# Altium project SDvp.PrjPcb
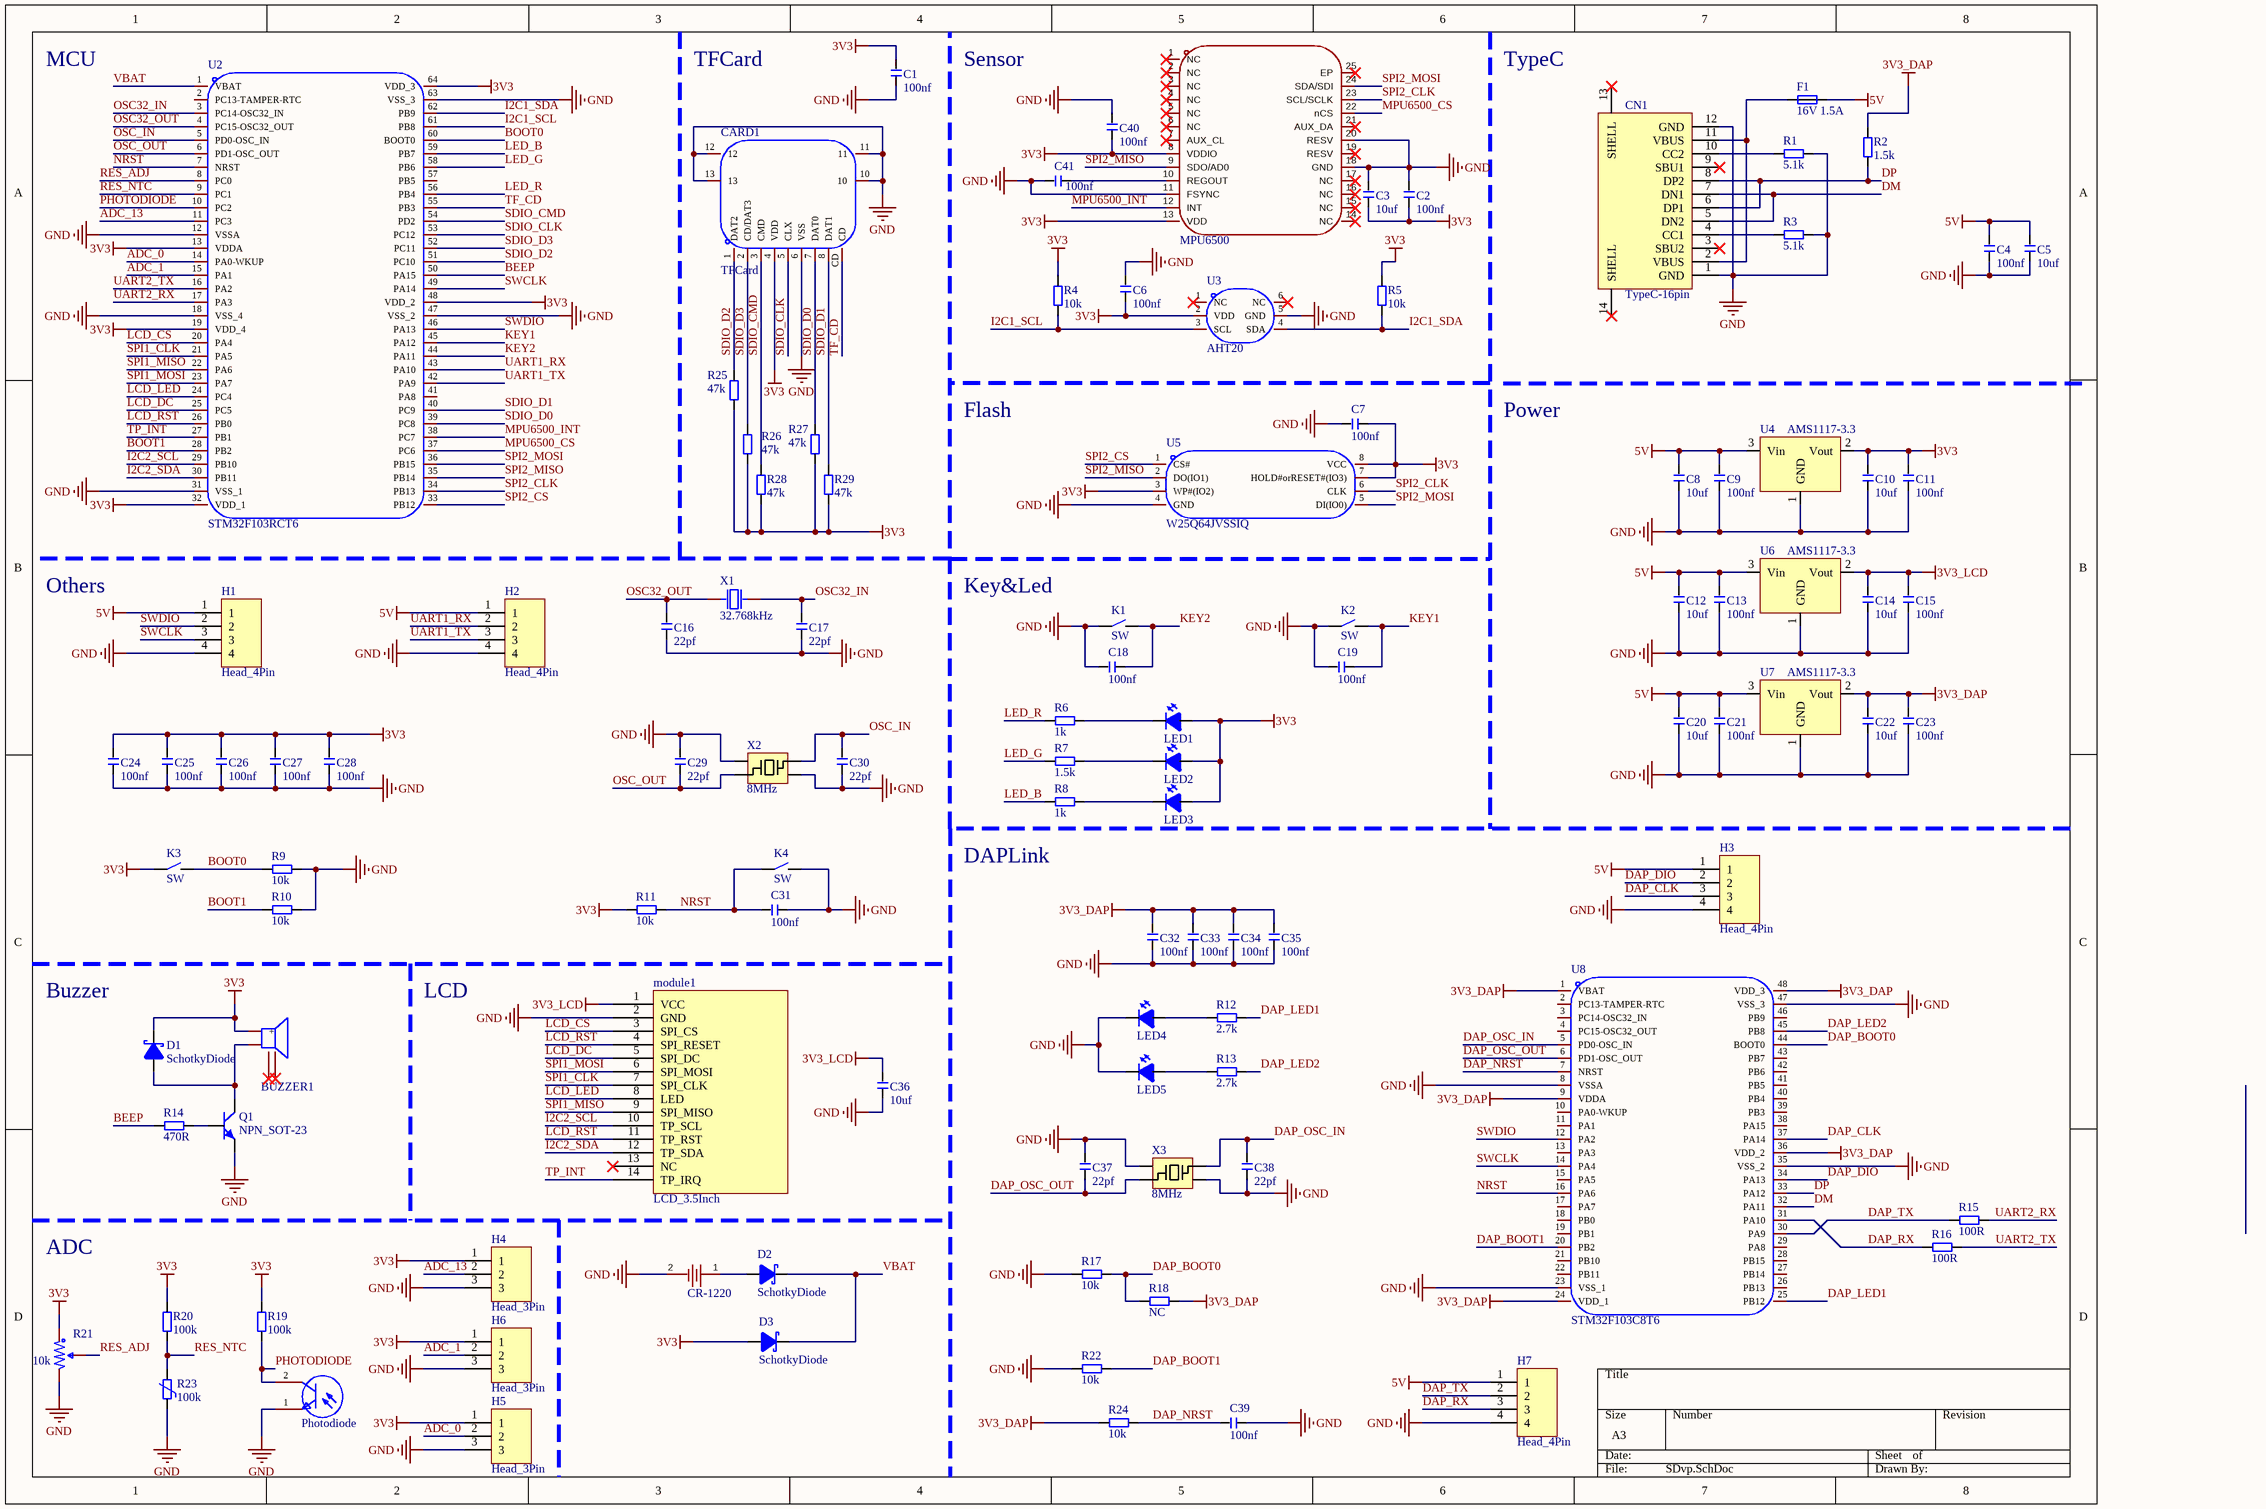
[diagram p0: SDvp.SchDoc]
1 sheet, 108 parts. Net scope: global (net labels, ports and power ports of the same name join across sheets).
Board file: SDvp.PcbDoc

## Sheet SDvp.SchDoc: S_develop
size A3; Revision: V0.1; SheetNumber: 1; SheetTotal: 1

### Parts
BUZZER1  PassiveBuzzer  [BUZ-SMD_8530]  (value not drawn)
C1  100nf  [CAP0603]
C2  100nf  [CAP0603]
C3  10uf  [CAP0603]
C4  100nf  [CAP0603]
C5  10uf  [CAP0603]
C6  100nf  [CAP0603]
C7  100nf  [CAP0603]
C8  10uf  [CAP0603]
C9  100nf  [CAP0603]
C10  10uf  [CAP0603]
C11  100nf  [CAP0603]
C12  10uf  [CAP0603]
C13  100nf  [CAP0603]
C14  10uf  [CAP0603]
C15  100nf  [CAP0603]
C16  22pf  [CAP0603]
C17  22pf  [CAP0603]
C18  100nf  [CAP0603]
C19  100nf  [CAP0603]
C20  10uf  [CAP0603]
C21  100nf  [CAP0603]
C22  10uf  [CAP0603]
C23  100nf  [CAP0603]
C24  100nf  [CAP0603]
C25  100nf  [CAP0603]
C26  100nf  [CAP0603]
C27  100nf  [CAP0603]
C28  100nf  [CAP0603]
C29  22pf  [CAP0603]
C30  22pf  [CAP0603]
C31  100nf  [CAP0603]
C32  100nf  [CAP0603]
C33  100nf  [CAP0603]
C34  100nf  [CAP0603]
C35  100nf  [CAP0603]
C36  10uf  [CAP0603]
C37  22pf  [CAP0603]
C38  22pf  [CAP0603]
C39  100nf  [CAP0603]
C40  100nf  [CAP0603]
C41  100nf  [CAP0603]
CARD1  TFCard  [TF-SMD]
CN1  TypeC-16pin  [USB-C-SMD_16Pin]
D1  SchotkyDiode  [SOD-323]
D2  SchotkyDiode  [SOD-323]
D3  SchotkyDiode  [SOD-323]
F1  16V 1.5A  [FUSE1206]
H1  Head_4Pin  [2.54排针_4PIN]
H2  Head_4Pin  [XH2.54_4Pin]
H3  Head_4Pin  [2.54排针_4PIN]
H4  Head_3Pin  [XH2.54_3Pin]
H5  Head_3Pin  [XH2.54_3Pin]
H6  Head_3Pin  [XH2.54_3Pin]
H7  Head_4Pin  [2.54排针_4PIN]
K1  SW  [SW-SMD_3425]
K2  SW  [SW-SMD_3425]
K3  SW  [SW-SMD_3425]
K4  SW  [SW-SMD_3425]
LED1  LED_R  [LED0603]  (value not drawn)
LED2  LED_G  [LED0603]  (value not drawn)
LED3  LED_B  [LED0603]  (value not drawn)
LED4  LED  [LED0603]  (value not drawn)
LED5  LED  [LED0603]  (value not drawn)
module1  LCD_3.5Inch  [LCD_3.5Inch]
Q1  NPN_SOT-23  [SOT-23-3]
R1  5.1k  [RES0603]
R2  1.5k  [RES0603]
R3  5.1k  [RES0603]
R4  10k  [RES0603]
R5  10k  [RES0603]
R6  1k  [RES0603]
R7  1.5k  [RES0603]
R8  1k  [RES0603]
R9  10k  [RES0603]
R10  10k  [RES0603]
R11  10k  [RES0603]
R12  2.7k  [RES0603]
R13  2.7k  [RES0603]
R14  470R  [RES0603]
R15  100R  [RES0603]
R16  100R  [RES0603]
R17  10k  [RES0603]
R18  NC  [RES0603]
R19  100k  [RES0603]
R20  100k  [RES0603]
R21  10k  [RES-ADJ-BuleWhite]
R22  10k  [RES0603]
R23  100k  [RES0603]
R24  10k  [RES0603]
R25  47k  [RES0603]
R26  47k  [RES0603]
R27  47k  [RES0603]
R28  47k  [RES0603]
R29  47k  [RES0603]
U1  MPU6500  [QFN-24]
U2  STM32F103RCT6  [LQFP-64]
U3  AHT20  [AHT20]
U4  AMS1117-3.3  [SOT223]
U5  W25Q64JVSSIQ  [SOIC-8]
U6  AMS1117-3.3  [SOT223]
U7  AMS1117-3.3  [SOT223]
U8  STM32F103C8T6  [LQFP-48]
U9  Photodiode  [Photodiode0603]
U10  CR-1220  [BAT-SMD_CR1220]
X1  32.768kHz  [XTAL_3215]
X2  8MHz  [XTAL_3225]
X3  8MHz  [XTAL_3225]

### Nets
3V3: BUZZER1.1(+) C1.2 C2.1 C3.1 C6.1 C7.1 C10.2 C11.2 C24.2 C25.2 C26.2 C27.2 C28.2 C40.1 CARD1.4(VDD) D1.2 D3.1 H4.1 H5.1 H6.1 K3.1 LED1.2 LED2.2 LED3.2 R4.2 R5.2 R11.1 R19.2 R20.2 R21.1 R25.1 R26.1 R27.1 R28.1 R29.1 U1.8(VDDIO) U1.13(VDD) U2.13(VDDA) U2.19(VDD_4) U2.32(VDD_1) U2.48(VDD_2) U2.64(VDD_3) U3.2(VDD) U4.2(Vout) U5.3(WP#(IO2)) U5.7(HOLD#orRESET#(IO3)) U5.8(VCC)
3V3_DAP: C22.2 C23.2 C32.2 C33.2 C34.2 C35.2 R2.1 R18.2 R24.1 U7.2(Vout) U8.1(VBAT) U8.9(VDDA) U8.24(VDD_1) U8.36(VDD_2) U8.48(VDD_3)
3V3_LCD: C14.2 C15.2 C36.2 module1.1(VCC) U6.2(Vout)
5V: C4.2 C5.2 C8.2 C9.2 C12.2 C13.2 C20.2 C21.2 F1.2 H1.1 H2.1 H3.1 H7.1 U4.3(Vin) U6.3(Vin) U7.3(Vin)
GND: C1.1 C2.2 C3.2 C4.1 C5.1 C6.2 C7.2 C8.1 C9.1 C10.1 C11.1 C12.1 C13.1 C14.1 C15.1 C16.1 C17.1 C18.2 C19.2 C20.1 C21.1 C22.1 C23.1 C24.1 C25.1 C26.1 C27.1 C28.1 C29.2 C30.1 C31.2 C32.1 C33.1 C34.1 C35.1 C36.1 C37.2 C38.1 C39.2 C40.2 C41.2 CARD1.6(VSS) CARD1.10 CARD1.11 CARD1.12 CARD1.13 CN1.1(GND) CN1.12(GND) H1.4 H2.4 H3.4 H4.3 H5.3 H6.3 H7.4 K1.1 K2.1 K4.2 LED4.1 LED5.1 module1.2(GND) Q1.2 R1.2 R3.2 R9.2 R10.2 R17.1 R21.3 R22.1 R23.1 U1.11(FSYNC) U1.18(GND) U1.20(RESV) U2.12(VSSA) U2.18(VSS_4) U2.31(VSS_1) U2.47(VSS_2) U2.63(VSS_3) U3.5(GND) U4.1(GND) U5.4(GND) U6.1(GND) U7.1(GND) U8.8(VSSA) U8.23(VSS_1) U8.35(VSS_2) U8.47(VSS_3) U9.1(E) U10.2 X2.2 X2.4 X3.2 X3.4
ADC_0: H5.2 U2.14(PA0-WKUP)
ADC_1: H6.2 U2.15(PA1)
ADC_13: H4.2 U2.11(PC3)
BEEP: R14.1 U2.50(PA15)
BOOT0: K3.2 R9.1 U2.60(BOOT0)
BOOT1: R10.1 U2.28(PB2)
DAP_BOOT0: R17.2 R18.1 U8.44(BOOT0)
DAP_BOOT1: R22.2 U8.20(PB2)
DAP_CLK: H3.3 U8.37(PA14)
DAP_DIO: H3.2 U8.34(PA13)
DAP_LED1: R12.2 U8.25(PB12)
DAP_LED2: R13.2 U8.45(PB8)
DAP_NRST: C39.1 R24.2 U8.7(NRST)
DAP_OSC_IN: C38.2 U8.5(PD0-OSC_IN) X3.3
DAP_OSC_OUT: C37.1 U8.6(PD1-OSC_OUT) X3.1
DAP_RX: H7.3 R16.1 U8.31(PA10)
DAP_TX: H7.2 R15.1 U8.30(PA9)
DM: CN1.5(DN2) CN1.7(DN1) U8.32(PA11)
DP: CN1.6(DP1) CN1.8(DP2) R2.2 U8.33(PA12)
I2C1_SCL: R4.1 U2.61(PB8) U3.3(SCL)
I2C1_SDA: R5.1 U2.62(PB9) U3.4(SDA)
I2C2_SCL: module1.10(TP_SCL) U2.29(PB10)
I2C2_SDA: module1.12(TP_SDA) U2.30(PB11)
KEY1: C19.1 K2.2 U2.45(PA12)
KEY2: C18.1 K1.2 U2.44(PA11)
LCD_CS: module1.3(SPI_CS) U2.20(PA4)
LCD_DC: module1.5(SPI_DC) U2.25(PC5)
LCD_LED: module1.8(LED) U2.24(PC4)
LCD_RST: module1.4(SPI_RESET) module1.11(TP_RST) U2.26(PB0)
LED_B: R8.2 U2.59(PB7)
LED_G: R7.2 U2.58(PB6)
LED_R: R6.1 U2.56(PB4)
MPU6500_CS: U1.22(nCS) U2.37(PC6)
MPU6500_INT: U1.12(INT) U2.38(PC7)
NRST: C31.1 K4.1 R11.2 U2.7(NRST) U8.16(PA6)
OSC32_IN: C17.2 U2.3(PC14-OSC32_IN) X1.2(OSC2)
OSC32_OUT: C16.2 U2.4(PC15-OSC32_OUT) X1.1(OSC1)
OSC_IN: C30.2 U2.5(PD0-OSC_IN) X2.3
OSC_OUT: C29.1 U2.6(PD1-OSC_OUT) X2.1
PHOTODIODE: R19.1 U2.10(PC2) U9.2(C)
RES_ADJ: R21.2 U2.8(PC0)
RES_NTC: R20.1 R23.2 U2.9(PC1)
SDIO_CLK: CARD1.5(CLX) U2.53(PC12)
SDIO_CMD: CARD1.3(CMD) R28.2 U2.54(PD2)
SDIO_D0: CARD1.7(DAT0) R27.2 U2.39(PC8)
SDIO_D1: CARD1.8(DAT1) R29.2 U2.40(PC9)
SDIO_D2: CARD1.1(DAT2) R25.2 U2.51(PC10)
SDIO_D3: CARD1.2(CD/DAT3) R26.2 U2.52(PC11)
SPI1_CLK: module1.7(SPI_CLK) U2.21(PA5)
SPI1_MISO: module1.9(SPI_MISO) U2.22(PA6)
SPI1_MOSI: module1.6(SPI_MOSI) U2.23(PA7)
SPI2_CLK: U1.23(SCL/SCLK) U2.34(PB13) U5.6(CLK)
SPI2_CS: U2.33(PB12) U5.1(CS#)
SPI2_MISO: U1.9(SDO/AD0) U2.35(PB14) U5.2(DO(IO1))
SPI2_MOSI: U1.24(SDA/SDI) U2.36(PB15) U5.5(DI(IO0))
SWCLK: H1.3 U2.49(PA14) U8.14(PA4)
SWDIO: H1.2 U2.46(PA13) U8.12(PA2)
TF_CD: CARD1.CD U2.55(PB3)
TP_INT: module1.14(TP_IRQ) U2.27(PB1)
UART1_RX: H2.2 U2.43(PA10)
UART1_TX: H2.3 U2.42(PA9)
UART2_RX: R15.2 U2.17(PA3)
UART2_TX: R16.2 U2.16(PA2)
VBAT: D2.2 D3.2 U2.1(VBAT)
NetBUZZER1_2: BUZZER1.2 D1.1 Q1.3
NetC41_1: C41.1 U1.10(REGOUT)
NetCN1_2: CN1.2(VBUS) CN1.11(VBUS) F1.1
NetCN1_4: CN1.4(CC1) R3.1
NetCN1_10: CN1.10(CC2) R1.1
NetD2_1: D2.1 U10.1
NetLED1_1: LED1.1 R6.2
NetLED2_1: LED2.1 R7.1
NetLED3_1: LED3.1 R8.1
NetLED4_2: LED4.2 R12.1
NetLED5_2: LED5.2 R13.1
NetQ1_1: Q1.1 R14.2

Not connected (* = marked no-connect by the designer): BUZZER1 3* 4*; CN1 3(SBU2)* 9(SBU1)* 13(SHELL)* 14(SHELL)*; module1 13(NC)*; U1 1(NC)* 2(NC)* 3(NC)* 4(NC)* 5(NC)* 6(NC)* 7(AUX_CL)* 14(NC)* 15(NC)* 16(NC)* 17(NC)* 19(RESV)* 21(AUX_DA)* 25(EP)*; U2 2(PC13-TAMPER-RTC) 41(PA8) 57(PB5); U3 1(NC)* 6(NC)*; U8 2(PC13-TAMPER-RTC) 3(PC14-OSC32_IN) 4(PC15-OSC32_OUT) 10(PA0-WKUP) 11(PA1) 13(PA3) 15(PA5) 17(PA7) 18(PB0) 19(PB1) 21(PB10) 22(PB11) 26(PB13) 27(PB14) 28(PB15) 29(PA8) 38(PA15) 39(PB3) 40(PB4) 41(PB5) 42(PB6) 43(PB7) 46(PB9)

### Notes on the sheet
- MCU
- TFCard
- Sensor
- TypeC
- Flash
- Power
- Others
- Key&Led
- (near R8) DAPLink
- Buzzer
- LCD
- ADC

### Library data of the parts
C1-C41 = Cap: MLCC无极性电容
  C1 C2 C4 C6 C7 C9 C11 C13 C15 C18 C19 C21 C23-C28 C31-C35 C39-C41: value: 100nf
  C3 C5 C8 C10 C12 C14 C20 C22 C36: value: 10uf
  C16 C17 C29 C30 C37 C38: value: 22pf
CARD1 = TFCard: Symbol: TF PUSH
D1-D3 = SchotkyDiode: 肖特基二极管
F1 = Fuse: 保险丝
K1-K4 = SW: 轻触开关
LED1-LED5 = LED: 发光二极管
Q1 = NPN_SOT-23: 三极管
R1-R20 R22 R24-R29 = Res: 电阻
  R1 R3: value: 5.1k
  R2 R7: value: 1.5k
  R4 R5 R9-R11 R17 R22 R24: value: 10k
  R6 R8: value: 1k
  R12 R13: value: 2.7k
  R14: value: 470R
  R15 R16: value: 100R
  R18: value: NC
  R19 R20: value: 100k
  R25-R29: value: 47k
R21 = RES_ADJ: 可调电位器; Symbol: RM065-103(10K)
R23 = RES_NTC: 热敏电阻
U1 = MPU6500: 陀螺仪芯片; Symbol: MPU6500
U2 = STM32F103RCT6: STM32F103; Symbol: STM32F103RCT6
U3 = AHT20: 温湿度芯片; Symbol: AHT20_C2757850
U4 U6 U7 = AMS1117-3.3: 降压芯片
U5 = W25Q64JVSSIQ: FLASH芯片; Symbol: W25Q64JVSSIQ_C179171
U8 = STM32F103C8T6: STM32F103; Symbol: STM32F103C8T6
U9 = Photodiode: 光敏二极管; Symbol: XYC-PT0603AC-LB1-S
U10 = CR-1220: CR-1220电池座; Symbol: XDCR-1220-006
X1 = XTAL_3215: 无源晶振3215; Symbol: XKXGI-SUA-32.768K
X2 X3 = XTAL_无源4脚
BUZZER1 = PassiveBuzzer: Symbol: MLT-8530